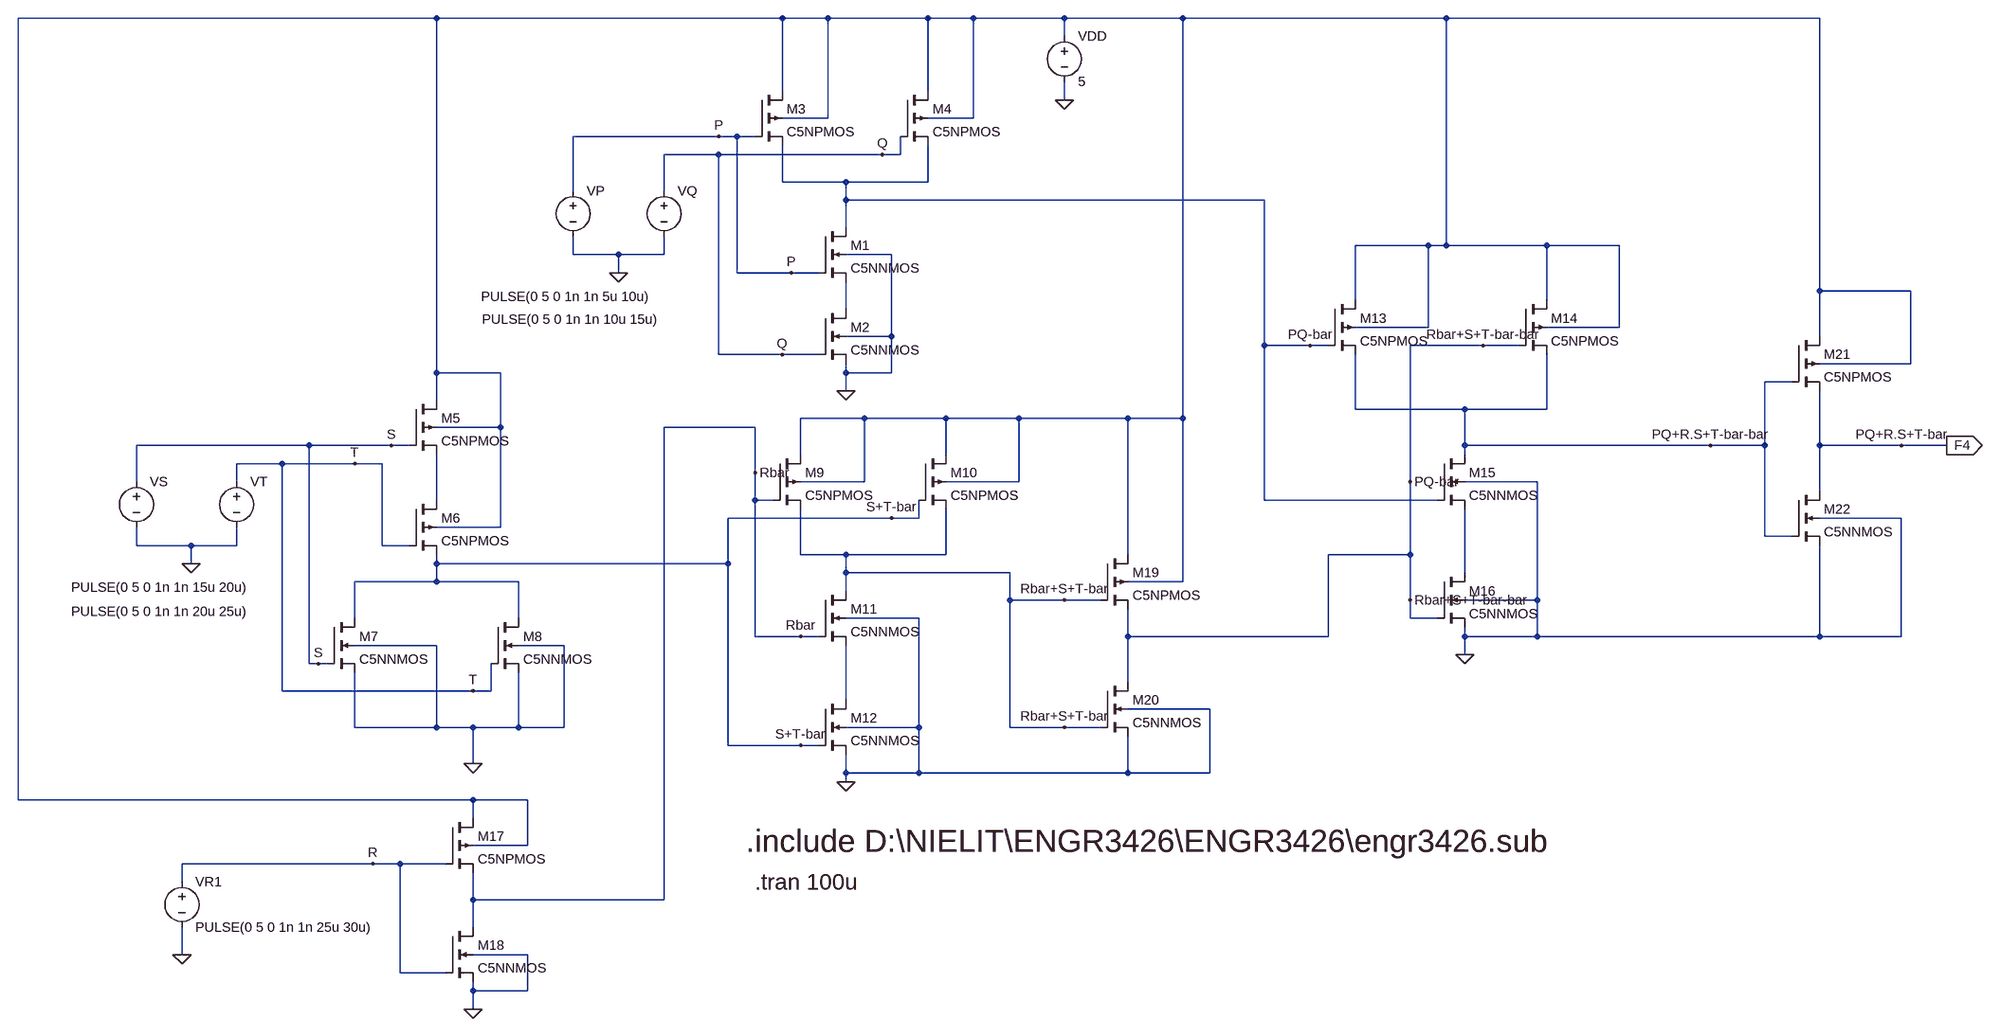
[diagram p0: schematic F4.asc]
F4.asc, the LTspice schematic file:
Version 4
SHEET 1 2056 1476
WIRE -688 -288 -1424 -288
WIRE -80 -288 -688 -288
WIRE 0 -288 -80 -288
WIRE 176 -288 0 -288
WIRE 256 -288 176 -288
WIRE 416 -288 256 -288
WIRE 624 -288 416 -288
WIRE 1088 -288 624 -288
WIRE 1744 -288 1088 -288
WIRE 416 -256 416 -288
WIRE -80 -160 -80 -288
WIRE 176 -160 176 -288
WIRE 416 -144 416 -176
WIRE 0 -112 0 -288
WIRE 0 -112 -80 -112
WIRE 256 -112 256 -288
WIRE 256 -112 176 -112
WIRE -192 -80 -448 -80
WIRE -160 -80 -192 -80
WIRE -128 -80 -160 -80
WIRE -192 -48 -288 -48
WIRE 96 -48 -192 -48
WIRE 128 -48 128 -80
WIRE 128 -48 96 -48
WIRE -80 0 -80 -64
WIRE 32 0 -80 0
WIRE 176 0 176 -64
WIRE 176 0 32 0
WIRE -448 16 -448 -80
WIRE -288 16 -288 -48
WIRE 32 32 32 0
WIRE 768 32 32 32
WIRE 32 80 32 32
WIRE 1056 112 928 112
WIRE 1088 112 1088 -288
WIRE 1088 112 1056 112
WIRE 1264 112 1088 112
WIRE 1392 112 1264 112
WIRE -448 128 -448 96
WIRE -368 128 -448 128
WIRE -288 128 -288 96
WIRE -288 128 -368 128
WIRE 112 128 32 128
WIRE -368 160 -368 128
WIRE -160 160 -160 -80
WIRE -64 160 -160 160
WIRE -16 160 -64 160
WIRE 1744 192 1744 -288
WIRE 1904 192 1744 192
WIRE 928 208 928 112
WIRE 1264 208 1264 112
WIRE 32 224 32 176
WIRE 1056 256 1056 112
WIRE 1056 256 928 256
WIRE 1392 256 1392 112
WIRE 1392 256 1264 256
WIRE 112 272 112 128
WIRE 112 272 32 272
WIRE 1744 272 1744 192
WIRE 768 288 768 32
WIRE 848 288 768 288
WIRE 880 288 848 288
WIRE 1152 288 1024 288
WIRE 1216 288 1152 288
WIRE -192 304 -192 -48
WIRE -80 304 -192 304
WIRE -16 304 -80 304
WIRE 1904 320 1904 192
WIRE 1904 320 1744 320
WIRE -688 336 -688 -288
WIRE -576 336 -688 336
WIRE 32 336 32 320
WIRE 112 336 112 272
WIRE 112 336 32 336
WIRE 1696 352 1648 352
WIRE 32 368 32 336
WIRE -688 384 -688 336
WIRE 928 400 928 304
WIRE 1120 400 928 400
WIRE 1264 400 1264 304
WIRE 1264 400 1120 400
WIRE 64 416 -48 416
WIRE 208 416 64 416
WIRE 336 416 208 416
WIRE 528 416 336 416
WIRE 624 416 624 -288
WIRE 624 416 528 416
WIRE -576 432 -576 336
WIRE -576 432 -688 432
WIRE -128 432 -288 432
WIRE -912 464 -1216 464
WIRE -768 464 -912 464
WIRE -736 464 -768 464
WIRE 1120 464 1120 400
WIRE 1552 464 1120 464
WIRE 1648 464 1648 352
WIRE 1648 464 1552 464
WIRE 1744 464 1744 368
WIRE 1888 464 1744 464
WIRE 1968 464 1888 464
WIRE -48 480 -48 416
WIRE 208 480 208 416
WIRE 1120 480 1120 464
WIRE -960 496 -1040 496
WIRE -832 496 -960 496
WIRE -784 496 -832 496
WIRE -128 512 -128 432
WIRE -1216 528 -1216 464
WIRE -1040 528 -1040 496
WIRE 64 528 64 416
WIRE 64 528 -48 528
WIRE 336 528 336 416
WIRE 336 528 208 528
WIRE 1024 528 1024 288
WIRE 1248 528 1120 528
WIRE 1744 544 1744 464
WIRE -688 560 -688 480
WIRE -128 560 -128 512
WIRE -96 560 -128 560
WIRE 768 560 768 288
WIRE 1072 560 768 560
WIRE 112 592 -176 592
WIRE 160 592 160 560
WIRE 160 592 112 592
WIRE 1888 592 1744 592
WIRE -576 608 -576 432
WIRE -576 608 -688 608
WIRE 1648 624 1648 464
WIRE 1696 624 1648 624
WIRE -1216 640 -1216 608
WIRE -1120 640 -1216 640
WIRE -1040 640 -1040 608
WIRE -1040 640 -1120 640
WIRE -784 640 -784 496
WIRE -736 640 -784 640
WIRE -48 656 -48 576
WIRE 32 656 -48 656
WIRE 208 656 208 576
WIRE 208 656 32 656
WIRE 528 656 528 416
WIRE 1024 656 1024 528
WIRE 1024 656 880 656
WIRE -1120 672 -1120 640
WIRE -688 672 -688 656
WIRE -176 672 -176 592
WIRE -176 672 -688 672
WIRE 32 688 32 656
WIRE 320 688 32 688
WIRE 1120 688 1120 576
WIRE -688 704 -688 672
WIRE -688 704 -832 704
WIRE -544 704 -688 704
WIRE 624 704 624 416
WIRE 624 704 528 704
WIRE 32 720 32 688
WIRE 320 736 320 688
WIRE 416 736 320 736
WIRE 480 736 416 736
WIRE 1024 736 1024 656
WIRE 1248 736 1248 528
WIRE 1248 736 1120 736
WIRE -832 768 -832 704
WIRE -544 768 -544 704
WIRE 160 768 32 768
WIRE 1024 768 1024 736
WIRE 1072 768 1024 768
WIRE -128 800 -128 560
WIRE -48 800 -128 800
WIRE -16 800 -48 800
WIRE 528 800 528 752
WIRE 880 800 880 656
WIRE 880 800 528 800
WIRE 1120 800 1120 784
WIRE 1248 800 1248 736
WIRE 1248 800 1120 800
WIRE 1744 800 1744 640
WIRE 1744 800 1248 800
WIRE 1888 800 1888 592
WIRE 1888 800 1744 800
WIRE -688 816 -832 816
WIRE -464 816 -544 816
WIRE 1120 832 1120 800
WIRE -912 848 -912 464
WIRE -896 848 -912 848
WIRE -880 848 -896 848
WIRE 528 880 528 800
WIRE -960 896 -960 496
WIRE -624 896 -960 896
WIRE -592 896 -592 848
WIRE -592 896 -624 896
WIRE 32 912 32 816
WIRE 672 928 528 928
WIRE -832 960 -832 864
WIRE -688 960 -688 816
WIRE -688 960 -832 960
WIRE -624 960 -688 960
WIRE -544 960 -544 864
WIRE -544 960 -624 960
WIRE -464 960 -464 816
WIRE -464 960 -544 960
WIRE 160 960 160 768
WIRE 160 960 32 960
WIRE 320 960 320 736
WIRE 416 960 320 960
WIRE 480 960 416 960
WIRE -176 992 -176 672
WIRE -48 992 -176 992
WIRE -16 992 -48 992
WIRE -624 1024 -624 960
WIRE 32 1040 32 1008
WIRE 160 1040 160 960
WIRE 160 1040 32 1040
WIRE 528 1040 528 976
WIRE 528 1040 160 1040
WIRE 672 1040 672 928
WIRE 672 1040 528 1040
WIRE 32 1056 32 1040
WIRE -1424 1088 -1424 -288
WIRE -624 1088 -1424 1088
WIRE -528 1088 -624 1088
WIRE -624 1120 -624 1088
WIRE -528 1168 -528 1088
WIRE -528 1168 -624 1168
WIRE -800 1200 -1136 1200
WIRE -752 1200 -800 1200
WIRE -672 1200 -752 1200
WIRE -1136 1232 -1136 1200
WIRE -624 1264 -624 1216
WIRE -288 1264 -288 432
WIRE -288 1264 -624 1264
WIRE -624 1312 -624 1264
WIRE -1136 1360 -1136 1312
WIRE -528 1360 -624 1360
WIRE -752 1392 -752 1200
WIRE -672 1392 -752 1392
WIRE -624 1424 -624 1408
WIRE -528 1424 -528 1360
WIRE -528 1424 -624 1424
WIRE -624 1456 -624 1424
FLAG 416 -144 0
FLAG 32 368 0
FLAG -368 160 0
FLAG -624 1024 0
FLAG -1120 672 0
FLAG 32 1056 0
FLAG 1120 832 0
FLAG -1136 1360 0
FLAG -624 1456 0
FLAG 1968 464 F4
IOPIN 1968 464 Out
FLAG -768 464 S
FLAG -832 496 T
FLAG -896 848 S
FLAG -624 896 T
FLAG -192 -80 P
FLAG 96 -48 Q
FLAG -64 160 P
FLAG -80 304 Q
FLAG 112 592 S+T-bar
FLAG -128 512 Rbar
FLAG -48 800 Rbar
FLAG -48 992 S+T-bar
FLAG 416 736 Rbar+S+T-bar
FLAG 416 960 Rbar+S+T-bar
FLAG 1152 288 Rbar+S+T-bar-bar
FLAG 848 288 PQ-bar
FLAG 1024 528 PQ-bar
FLAG 1024 736 Rbar+S+T-bar-bar
FLAG 1552 464 PQ+R.S+T-bar-bar
FLAG -800 1200 R
FLAG 1888 464 PQ+R.S+T-bar
SYMBOL nmos4 -16 80 R0
SYMATTR InstName M1
SYMATTR Value C5NNMOS
SYMATTR Value2 l=0.6u w=3.6u
SYMBOL nmos4 -16 224 R0
SYMATTR InstName M2
SYMATTR Value C5NNMOS
SYMATTR Value2 l=0.6u w=3.6u
SYMBOL pmos4 -128 -160 R0
SYMATTR InstName M3
SYMATTR Value C5NPMOS
SYMATTR Value2 l=0.6u w=7.2u
SYMBOL pmos4 128 -160 R0
SYMATTR InstName M4
SYMATTR Value C5NPMOS
SYMATTR Value2 l=0.6u w=7.2u
SYMBOL voltage -448 0 R0
WINDOW 3 -162 202 Left 2
WINDOW 123 0 0 Left 0
WINDOW 39 0 0 Left 0
SYMATTR Value PULSE(0 5 0 1n 1n 5u 10u)
SYMATTR InstName VP
SYMBOL voltage -288 0 R0
WINDOW 3 -320 242 Left 2
WINDOW 123 0 0 Left 0
WINDOW 39 0 0 Left 0
SYMATTR Value PULSE(0 5 0 1n 1n 10u 15u)
SYMATTR InstName VQ
SYMBOL voltage 416 -272 R0
SYMATTR InstName VDD
SYMATTR Value 5
SYMBOL pmos4 -736 384 R0
SYMATTR InstName M5
SYMATTR Value C5NPMOS
SYMATTR Value2 l=0.6u w=7.2u
SYMBOL pmos4 -736 560 R0
SYMATTR InstName M6
SYMATTR Value C5NPMOS
SYMATTR Value2 l=0.6u w=7.2u
SYMBOL nmos4 -880 768 R0
SYMATTR InstName M7
SYMATTR Value C5NNMOS
SYMATTR Value2 l=0.6u w=3.6u
SYMBOL nmos4 -592 768 R0
SYMATTR InstName M8
SYMATTR Value C5NNMOS
SYMATTR Value2 l=0.6u w=3.6u
SYMBOL voltage -1216 512 R0
WINDOW 3 -115 202 Left 2
WINDOW 123 0 0 Left 0
WINDOW 39 0 0 Left 0
SYMATTR Value PULSE(0 5 0 1n 1n 15u 20u)
SYMATTR InstName VS
SYMBOL voltage -1040 512 R0
WINDOW 3 -291 244 Left 2
WINDOW 123 0 0 Left 0
WINDOW 39 0 0 Left 0
SYMATTR Value PULSE(0 5 0 1n 1n 20u 25u)
SYMATTR InstName VT
SYMBOL pmos4 -96 480 R0
SYMATTR InstName M9
SYMATTR Value C5NPMOS
SYMATTR Value2 l=0.6u w=7.2u
SYMBOL pmos4 160 480 R0
SYMATTR InstName M10
SYMATTR Value C5NPMOS
SYMATTR Value2 l=0.6u w=7.2u
SYMBOL nmos4 -16 720 R0
SYMATTR InstName M11
SYMATTR Value C5NNMOS
SYMATTR Value2 l=0.6u w=3.6u
SYMBOL nmos4 -16 912 R0
SYMATTR InstName M12
SYMATTR Value C5NNMOS
SYMATTR Value2 l=0.6u w=3.6u
SYMBOL pmos4 880 208 R0
SYMATTR InstName M13
SYMATTR Value C5NPMOS
SYMATTR Value2 l=0.6u w=7.2u
SYMBOL pmos4 1216 208 R0
SYMATTR InstName M14
SYMATTR Value C5NPMOS
SYMATTR Value2 l=0.6u w=7.2u
SYMBOL nmos4 1072 480 R0
SYMATTR InstName M15
SYMATTR Value C5NNMOS
SYMATTR Value2 l=0.6u w=3.6u
SYMBOL nmos4 1072 688 R0
SYMATTR InstName M16
SYMATTR Value C5NNMOS
SYMATTR Value2 l=0.6u w=3.6u
SYMBOL pmos4 -672 1120 R0
SYMATTR InstName M17
SYMATTR Value C5NPMOS
SYMATTR Value2 l=0.6u w=7.2u
SYMBOL nmos4 -672 1312 R0
SYMATTR InstName M18
SYMATTR Value C5NNMOS
SYMATTR Value2 l=0.6u w=3.6u
SYMBOL voltage -1136 1216 R0
WINDOW 123 0 0 Left 0
WINDOW 39 0 0 Left 0
SYMATTR InstName VR1
SYMATTR Value PULSE(0 5 0 1n 1n 25u 30u)
SYMBOL pmos4 480 656 R0
SYMATTR InstName M19
SYMATTR Value C5NPMOS
SYMATTR Value2 l=0.6u w=7.2u
SYMBOL nmos4 480 880 R0
SYMATTR InstName M20
SYMATTR Value C5NNMOS
SYMATTR Value2 l=0.6u w=3.6u
SYMBOL pmos4 1696 272 R0
SYMATTR InstName M21
SYMATTR Value C5NPMOS
SYMATTR Value2 l=0.6u w=7.2u
SYMBOL nmos4 1696 544 R0
SYMATTR InstName M22
SYMATTR Value C5NNMOS
SYMATTR Value2 l=0.6u w=3.6u
TEXT -144 1160 Left 5 !.include D:\\NIELIT\\ENGR3426\\ENGR3426\\engr3426.sub
TEXT -128 1232 Left 4 !.tran 100u

The netlist it stands for:
* F4.asc
M1 PQ-bar P N002 0 C5NNMOS l=0.6u w=3.6u
M2 N002 Q 0 0 C5NNMOS l=0.6u w=3.6u
M3 N001 P PQ-bar N001 C5NPMOS l=0.6u w=7.2u
M4 N001 Q PQ-bar N001 C5NPMOS l=0.6u w=7.2u
VP P 0 PULSE(0 5 0 1n 1n 5u 10u)
VQ Q 0 PULSE(0 5 0 1n 1n 10u 15u)
VDD N001 0 5
M5 N001 S N003 N001 C5NPMOS l=0.6u w=7.2u
M6 N003 T S+T-bar N001 C5NPMOS l=0.6u w=7.2u
M7 S+T-bar S 0 0 C5NNMOS l=0.6u w=3.6u
M8 S+T-bar T 0 0 C5NNMOS l=0.6u w=3.6u
VS S 0 PULSE(0 5 0 1n 1n 15u 20u)
VT T 0 PULSE(0 5 0 1n 1n 20u 25u)
M9 N001 Rbar Rbar+S+T-bar N001 C5NPMOS l=0.6u w=7.2u
M10 N001 S+T-bar Rbar+S+T-bar N001 C5NPMOS l=0.6u w=7.2u
M11 Rbar+S+T-bar Rbar N005 0 C5NNMOS l=0.6u w=3.6u
M12 N005 S+T-bar 0 0 C5NNMOS l=0.6u w=3.6u
M13 N001 PQ-bar PQ+R.S+T-bar-bar N001 C5NPMOS l=0.6u w=7.2u
M14 N001 PQ-bar PQ+R.S+T-bar-bar N001 C5NPMOS l=0.6u w=7.2u
M15 PQ+R.S+T-bar-bar PQ-bar N004 0 C5NNMOS l=0.6u w=3.6u
M16 N004 PQ-bar 0 0 C5NNMOS l=0.6u w=3.6u
M17 N001 R Rbar N001 C5NPMOS l=0.6u w=7.2u
M18 Rbar R 0 0 C5NNMOS l=0.6u w=3.6u
VR1 R 0 PULSE(0 5 0 1n 1n 25u 30u)
M19 N001 Rbar+S+T-bar PQ-bar N001 C5NPMOS l=0.6u w=7.2u
M20 PQ-bar Rbar+S+T-bar 0 0 C5NNMOS l=0.6u w=3.6u
M21 N001 PQ+R.S+T-bar-bar PQ+R.S+T-bar N001 C5NPMOS l=0.6u w=7.2u
M22 PQ+R.S+T-bar PQ+R.S+T-bar-bar 0 0 C5NNMOS l=0.6u w=3.6u
.model NMOS NMOS
.model PMOS PMOS
.lib standard.mos
.include D:\NIELIT\ENGR3426\ENGR3426\engr3426.sub
.tran 100u
.backanno
.end